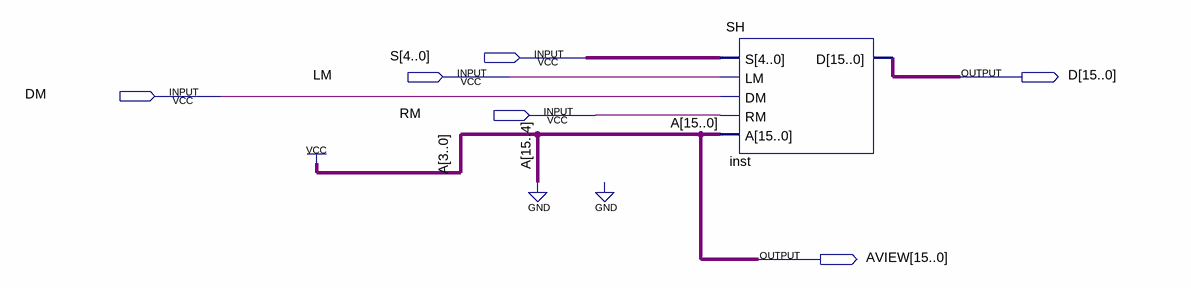
[diagram p0: schematic sheet]
// Quartus schematic exp34.bdf as structural Verilog: 1 symbols, 6 pins
module exp34 (
  input  [4:0] S,
  input  LM,
  input  DM,
  input  RM,
  output [15:0] D,
  output [15:0] AVIEW
);

  SH inst (.S(S), .LM(LM), .DM(DM), .RM(RM), .A(16'b0000000000001111), .D(D));

  assign AVIEW = 16'b0000000000001111;
endmodule
